# EAGLE schematic ProgCalc (EAGLE 9.3.0)
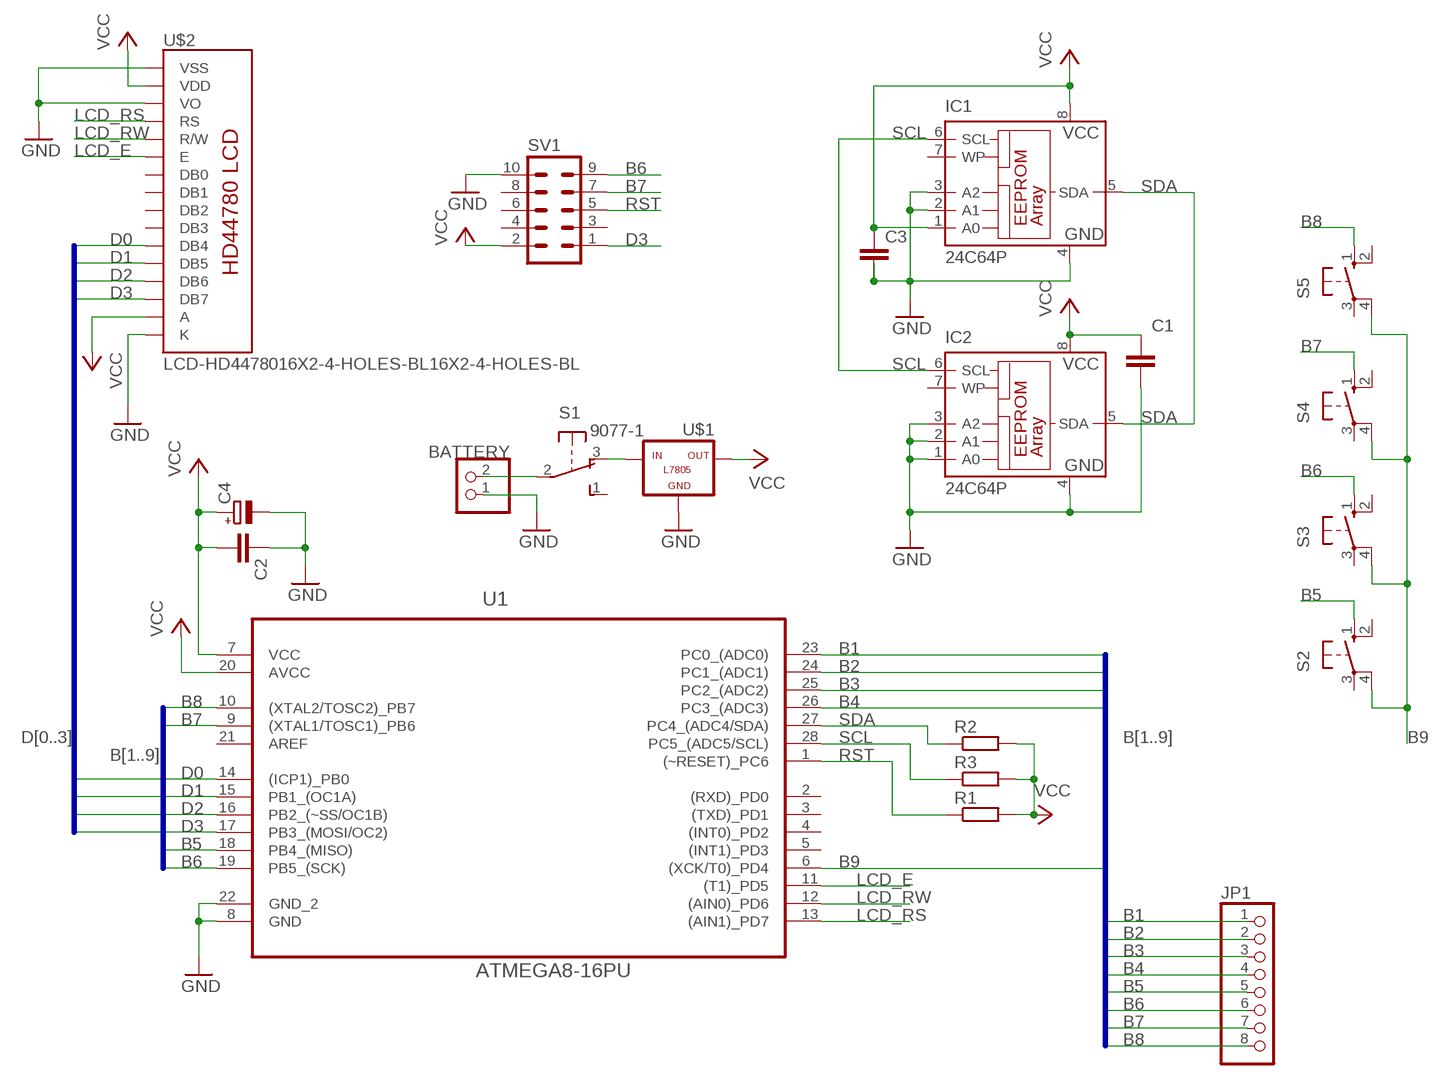
[diagram p0: schematic, sheet 1]

## Parts
BATTERY  PINHD-1X2/90  [1X02/90]
C1  C-EU025-025X050  [C025-025X050]
C2  C-EU025-025X050  [C025-025X050]
C3  C-EU025-025X050  [C025-025X050]
C4  CPOL-EUE1.8-4  [E1,8-4]
IC1  24C64P  [DIL8]
IC2  24C64P  [DIL8]
JP1  PINHD-1X8/90  [1X08/90]
R1  R-EU_0204/7  [0204/7]
R2  R-EU_0204/7  [0204/7]
R3  R-EU_0204/7  [0204/7]
S1  9077-1  [9077-1]
S2  10-XX  [B3F-10XX]
S3  10-XX  [B3F-10XX]
S4  10-XX  [B3F-10XX]
S5  10-XX  [B3F-10XX]
SV1  ML10L  [ML10L]
U1  ATMEGA8-16PU  [DIP254P762X457-28]
U$1  -L7805  [L7805]
U$2  LCD-HD4478016X2-4-HOLES-BL16X2-4-HOLES-BL  [LCD-16X2-4HOLES-BL]

## Nets
B1: JP1.1 U1.23(PC0_(ADC0))
B2: JP1.2 U1.24(PC1_(ADC1))
B3: JP1.3 U1.25(PC2_(ADC2))
B4: JP1.4 U1.26(PC3_(ADC3))
B5: JP1.5 S2.1(S) U1.18(PB4_(MISO))
B6: JP1.6 S3.1(S) SV1.9 U1.19(PB5_(SCK))
B7: JP1.7 S4.1(S) SV1.7 U1.9((XTAL1/TOSC1)_PB6)
B8: JP1.8 S5.1(S) U1.10((XTAL2/TOSC2)_PB7)
B9: S2.4(P1) S3.4(P1) S4.4(P1) S5.4(P1) U1.6((XCK/T0)_PD4)
D0: U1.14((ICP1)_PB0) U$2.11(DB4)
D1: U1.15(PB1_(OC1A)) U$2.12(DB5)
D2: U1.16(PB2_(~SS/OC1B)) U$2.13(DB6)
D3: SV1.1 U1.17(PB3_(MOSI/OC2)) U$2.14(DB7)
GND: BATTERY.1 C1.2 C2.1 C3.2 C4.- IC1.2(A1) IC1.3(A2) IC1.4(GND) IC2.1(A0) IC2.2(A1) IC2.3(A2) IC2.4(GND) SV1.10 U1.8(GND) U1.22(GND_2) U$1.GND U$2.1(VSS) U$2.3(VO) U$2.16(K)
LCD_E: U1.11((T1)_PD5) U$2.6(E)
LCD_RS: U1.13((AIN1)_PD7) U$2.4(RS)
LCD_RW: U1.12((AIN0)_PD6) U$2.5(R/W)
N$1: S1.3(O) U$1.IN
N$2: BATTERY.2 S1.2(P)
RST: R1.1 SV1.5 U1.1((~RESET)_PC6)
SCL: IC1.6(SCL) IC2.6(SCL) R3.1 U1.28(PC5_(ADC5/SCL))
SDA: IC1.5(SDA) IC2.5(SDA) R2.1 U1.27(PC4_(ADC4/SDA))
VCC: C1.1 C2.2 C3.1 C4.+ IC1.1(A0) IC1.8(VCC) IC2.8(VCC) R1.2 R2.2 R3.2 SV1.2 U1.7(VCC) U1.20(AVCC) U$1.OUT U$2.2(VDD) U$2.15(A)
Unconnected: IC1.7(WP) IC2.7(WP) S1.1(S) S2.2(S1) S2.3(P) S3.2(S1) S3.3(P) S4.2(S1) S4.3(P) S5.2(S1) S5.3(P) SV1.3 SV1.4 SV1.6 SV1.8 U1.2((RXD)_PD0) U1.3((TXD)_PD1) U1.4((INT0)_PD2) U1.5((INT1)_PD3) U1.21(AREF) U$2.7(DB0) U$2.8(DB1) U$2.9(DB2) U$2.10(DB3)

## Buses
B[1..9]
D[0..3]

## Library data of the parts
BATTERY = pinhead:PINHD-1X2: PIN HEADER
C1-C3 = rcl:C-EU: CAPACITOR, European symbol; SPICEPREFIX: C
C4 = rcl:CPOL-EU: POLARIZED CAPACITOR, European symbol; SPICEPREFIX: C
IC1 IC2 = microchip:24*: Serial EEPROM I2C; MF: RAMTRON INTERNATIONAL CORP; MPN: FM24C64-P; OC_FARNELL: 1362657; OC_NEWARK: 97H6452
JP1 = pinhead:PINHD-1X8: PIN HEADER
R1-R3 = rcl:R-EU_: RESISTOR, European symbol; SPICEPREFIX: R
S1 = switch-misc:9077-1: MARQUARDT SWITCH 9077.0100 Distributor: Buerklin <https://www.buerklin.com/default.asp?event=ShowArtikel%2812G2820%29&l=d&jump=ArtNr_12G2820>
S2-S5 = switch-omron:10-XX: OMRON SWITCH; MPN: B3F-1000; OC_FARNELL: 176432; OC_NEWARK: 36M3542
SV1 = con-harting-ml:ML10: HARTING; OC_FARNELL: unknown; OC_NEWARK: unknown
U1 = Atmel_By_element14_Batch_1-00:ATMEGA8-16PU: Programmable Flash; DESCRIPTION: Programmable Flash; MPN: ATMEGA8-16PU; OC_FARNELL: 9171380; OC_NEWARK: 01M6901; PACKAGE: PCDIP-28; SUPPLIER: ATMEL
U$1 = tango:-L7805
U$2 = HD44780LCD:LCD-HD44780